# EAGLE design reza-connectboard (EAGLE 6.4)
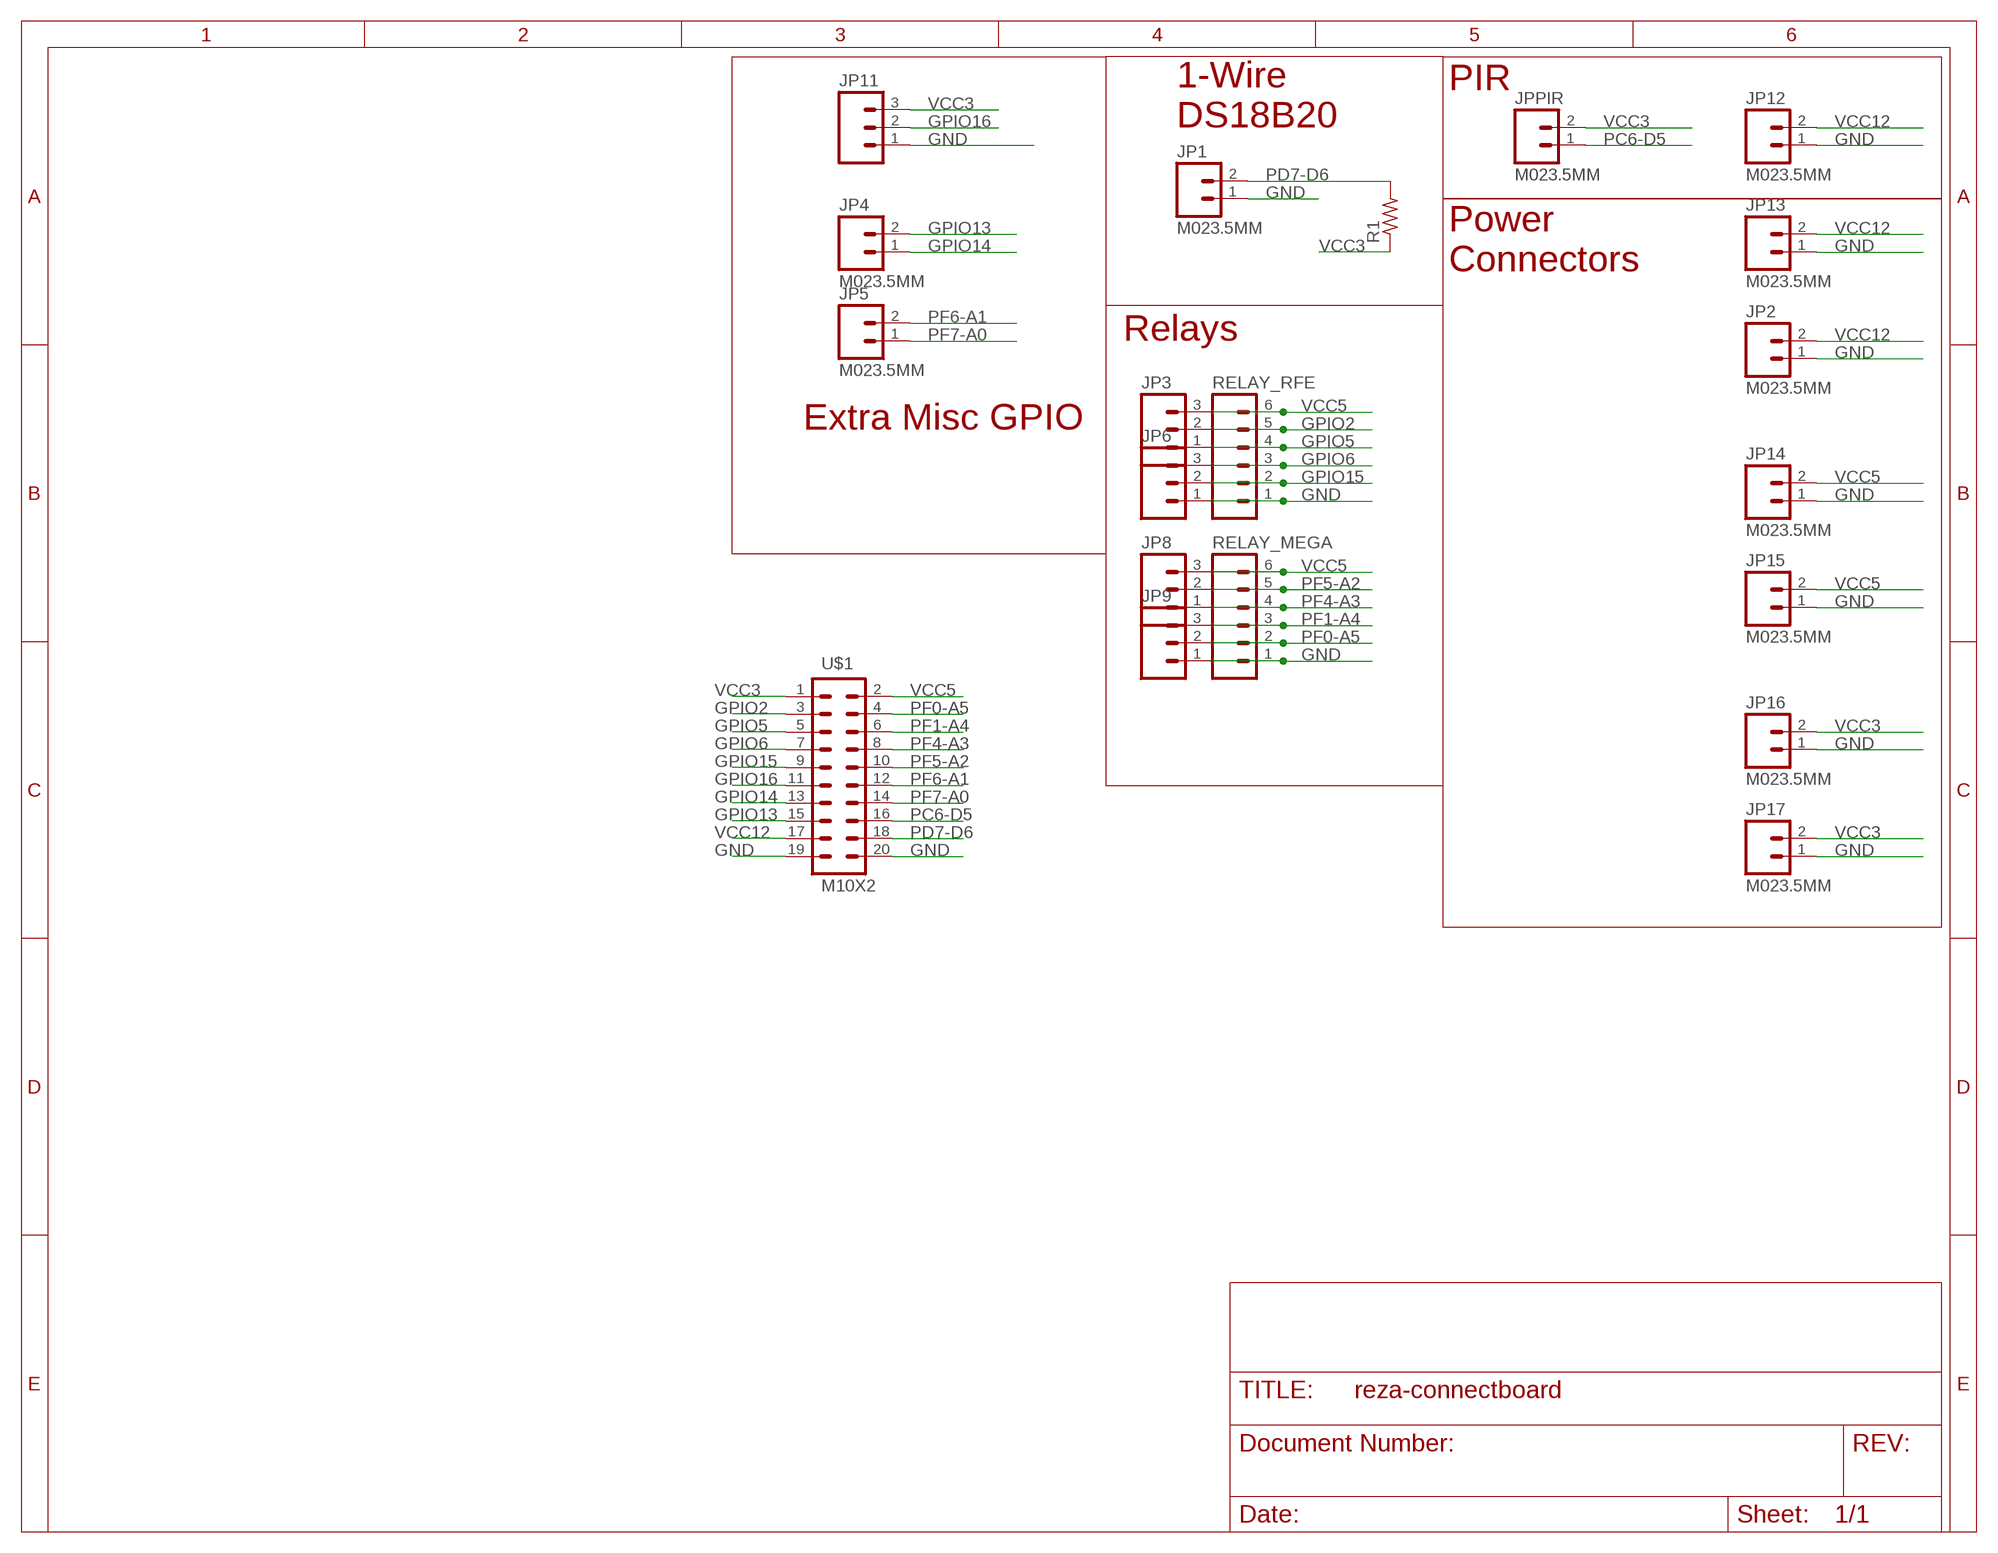
[diagram p0: schematic, sheet 1]

## Parts
JP1  M023.5MM  [SCREWTERMINAL-3.5MM-2]
JP2  M023.5MM  [SCREWTERMINAL-3.5MM-2]
JP3  M03SCREW  [SCREWTERMINAL-3.5MM-3]
JP4  M023.5MM  [SCREWTERMINAL-3.5MM-2]
JP5  M023.5MM  [SCREWTERMINAL-3.5MM-2]
JP6  M03SCREW  [SCREWTERMINAL-3.5MM-3]
JP8  M03SCREW  [SCREWTERMINAL-3.5MM-3]
JP9  M03SCREW  [SCREWTERMINAL-3.5MM-3]
JP11  M03SCREW  [SCREWTERMINAL-3.5MM-3]
JP12  M023.5MM  [SCREWTERMINAL-3.5MM-2]
JP13  M023.5MM  [SCREWTERMINAL-3.5MM-2]
JP14  M023.5MM  [SCREWTERMINAL-3.5MM-2]
JP15  M023.5MM  [SCREWTERMINAL-3.5MM-2]
JP16  M023.5MM  [SCREWTERMINAL-3.5MM-2]
JP17  M023.5MM  [SCREWTERMINAL-3.5MM-2]
JPPIR  M023.5MM  [SCREWTERMINAL-3.5MM-2]
R1  R-US_FLIPFLOP  [0805-THM]
RELAY_MEGA  M06SIP  [1X06]
RELAY_RFE  M06SIP  [1X06]
U$1  M10X2  [2X10]

## Nets
GND: JP1.1 JP2.1 JP6.1 JP9.1 JP11.1 JP12.1 JP13.1 JP14.1 JP15.1 JP16.1 JP17.1 RELAY_MEGA.1 RELAY_RFE.1 U$1.19 U$1.20
GPIO2: JP3.2 RELAY_RFE.5 U$1.3
GPIO5: JP3.1 RELAY_RFE.4 U$1.5
GPIO6: JP6.3 RELAY_RFE.3 U$1.7
GPIO13 [smallsignal]: JP4.2 U$1.15
GPIO14 [smallsignal]: JP4.1 U$1.13
GPIO15: JP6.2 RELAY_RFE.2 U$1.9
GPIO16: JP11.2 U$1.11
PC6-D5 [smallsignal]: JPPIR.1 U$1.16
PD7-D6 [smallsignal]: JP1.2 R1.2 U$1.18
PF0-A5 [smallsignal]: JP9.2 RELAY_MEGA.2 U$1.4
PF1-A4 [smallsignal]: JP9.3 RELAY_MEGA.3 U$1.6
PF4-A3 [smallsignal]: JP8.1 RELAY_MEGA.4 U$1.8
PF5-A2 [smallsignal]: JP8.2 RELAY_MEGA.5 U$1.10
PF6-A1 [smallsignal]: JP5.2 U$1.12
PF7-A0 [smallsignal]: JP5.1 U$1.14
VCC3: JP11.3 JP16.2 JP17.2 JPPIR.2 R1.1 U$1.1
VCC5: JP3.3 JP8.3 JP14.2 JP15.2 RELAY_MEGA.6 RELAY_RFE.6 U$1.2
VCC12 [Power]: JP2.2 JP12.2 JP13.2 U$1.17

## Notes on the sheet
- PIR
- 1-Wire
  DS18B20
- Power
  Connectors
- Relays
- Extra Misc GPIO

## Library data of the parts
JP1 JP2 JP4 JP5 JP12-JP17 JPPIR = SparkFun-Connectors:M02: Standard 2-pin 0.1" header. Use with - straight break away headers ( PRT-00116) - right angle break away headers (PRT-00553) - swiss pins (PRT-00743) - machine pins (PRT-00117) - female headers (PRT-00115) Molex polarized connector foot print use with: PRT-08233 with associated crimp pins and housings. 2.54_SCREWTERM for use with PRT-10571. 3.5mm Screw Terminal footprints for PRT-08084 5mm Screw Terminal footprints for use with PRT-08433
JP3 JP6 JP8 JP9 JP11 = SparkFun-Connectors:M03: Header 3 Standard 3-pin 0.1" header. Use with straight break away headers (SKU : PRT-00116), right angle break away headers (PRT-00553), swiss pins (PRT-00743), machine pins (PRT-00117), and female headers (PRT-00115). Molex polarized connector foot print use with SKU : PRT-08232 with associated crimp pins and housings.
R1 = adafruit:R-US_: RESISTOR, American symbol
RELAY_MEGA RELAY_RFE = SparkFun-Connectors:M06: Header 6 Standard 6-pin 0.1" header. Use with straight break away headers (SKU : PRT-00116), right angle break away headers (PRT-00553), swiss pins (PRT-00743), machine pins (PRT-00117), and female headers (PRT-00115). Molex polarized connector foot print use with SKU : PRT-08094 with associated crimp pins and housings. NOTES ON THE VARIANTS LOCK and LOCK_LONGPADS... This footprint was designed to help hold the alignment of a through-hole component (i.e. 6-pin header) while soldering it into place. You may notice that each hole has been shifted either up or down by 0.005 of an inch from it's more standard position (which is a perfectly straight line). This slight alteration caused the pins (the squares in the middle) to touch the edges of the holes. Because they are alternating, it causes a "brace" to hold the component in place. 0.005 has proven to be the perfect amount of "off-center" position when using our standard breakaway headers. Although looks a little odd when you look at the bare footprint, once you have a header in there, the alteration is very hard to notice. Also,if you push a header all the way into place, it is covered up entirely on the bottom side. This idea of altering the position of holes to aid alignment will be further integrated into the Sparkfun Library for other footprints. It can help hold any component with 3 or more connection pins.
U$1 = SparkFun-Connectors:M10X2: This was SPECIALLY designed to be used with our Graphic LCD Backpack. Be sure you want to use this! It is not only staggered on each line of header holes, but IT IS ALSO offset of the center point of the top and bottom lines by 5 mil. This causes the headers to lock into place on the "standard" footprint on the LCD screen. The extra squares on the tdocu layer are there simply to reference other pins (if you were to actually populate a longer header than ten long - this is what we do with the backpacks).

## Net classes
0 default: width 0.254 mm
1 smallsignal: width 0.254 mm
2 Power: width 0.508 mm

## Board
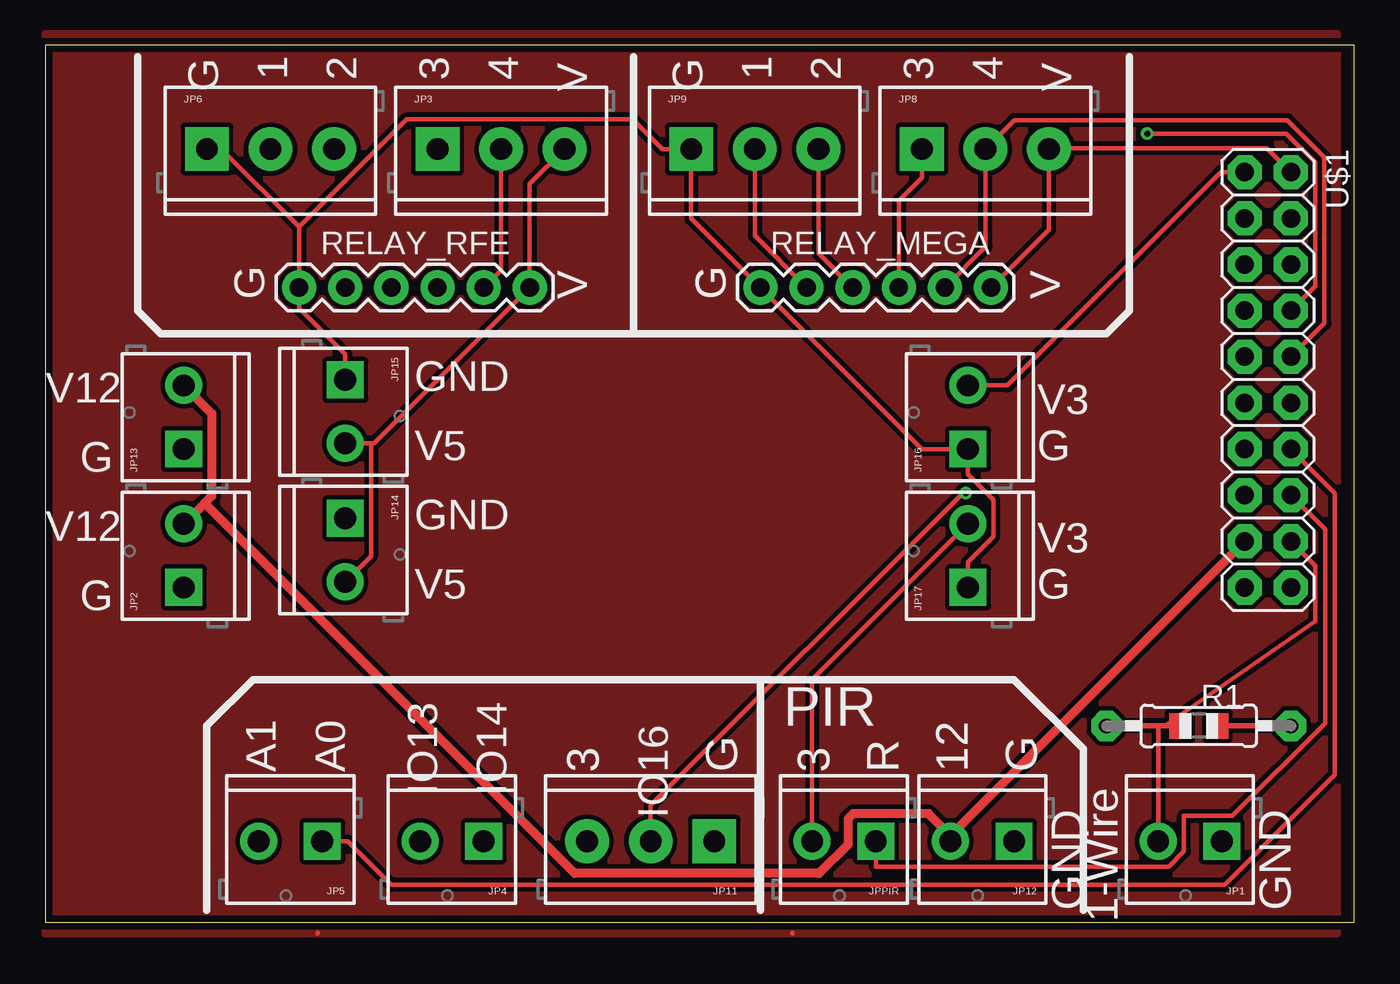
[diagram p1: board, top side]
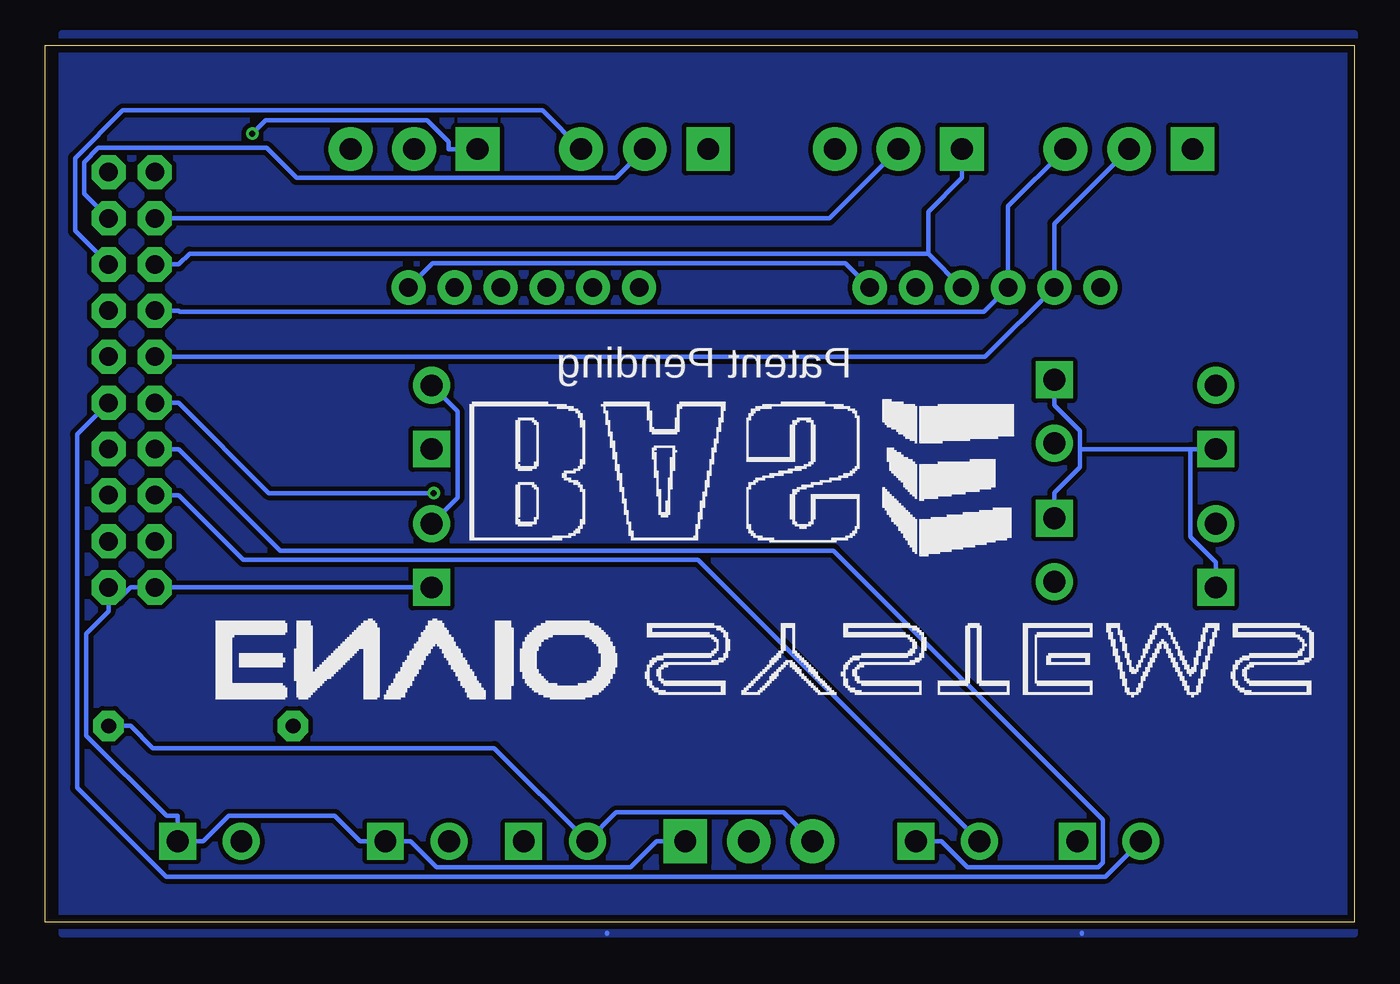
[diagram p2: board, bottom side, seen from below]

Size 72.06 x 48.25 mm. Coordinates in mm from the lower left corner, seen from the top.
Outline: 0,0 72.06,0 72.06,48.25 0,48.25 0,0
Copper layers (1*16): Top 0.0356mm / dielectric 1.5011mm / Bottom 0.0356mm
Design rules "LaenPCBOrder-JCModified *": minimum track width 6mil, minimum drill 13mil, track to track 10mil, track to pad 10mil, pad to pad 10mil, via to via 10mil, smd to smd 10mil, copper to edge 15mil, drill to drill 10mil, minimum pad ring 12mil, minimum via ring 7mil, stop-mask expansion 4mil, vias tented up to drill 25mil, thermal gap 10mil

### Footprints (pad centres in the part's own frame; a part is rotated, then mirrored left to right if it is on the bottom)
SCREWTERMINAL-3.5MM-2 = drill 1.2 pad 2.032 square: 1 0,0 | drill 1.2 pad 2.032: 2 3.5,0
SCREWTERMINAL-3.5MM-3 = drill 1.2 pad 2.413 square: 1 0,0 | drill 1.2 pad 2.413: 2 3.5,0; 3 7,0
0805-THM = drill 0.813 pad 1.676 octagon: 1 -5.08,0; 2 5.08,0
1X06 = drill 1.016 pad 1.88: 1 0,0; 2 2.54,0; 3 5.08,0; 4 7.62,0; 5 10.16,0; 6 12.7,0
2X10 = drill 1.016 pad 1.88 octagon: 1 -11.43,-1.27; 2 -11.43,1.27; 3 -8.89,-1.27; 4 -8.89,1.27; 5 -6.35,-1.27; 6 -6.35,1.27; 7 -3.81,-1.27; 8 -3.81,1.27; 9 -1.27,-1.27; 10 -1.27,1.27; 11 1.27,-1.27; 12 1.27,1.27; 13 3.81,-1.27; 14 3.81,1.27; 15 6.35,-1.27; 16 6.35,1.27; 17 8.89,-1.27; 18 8.89,1.27; 19 11.43,-1.27; 20 11.43,1.27

### Placement (x,y rotation side)
JP1  64.77,4.45 180 top
JP2  7.62,18.41 90 top
JP3  21.59,42.55 0 top
JP4  24.13,4.45 180 top
JP5  15.24,4.45 180 top
JP6  8.89,42.55 0 top
JP8  48.26,42.55 0 top
JP9  35.56,42.55 0 top
JP11  36.83,4.45 180 top
JP12  53.34,4.45 180 top
JP13  7.62,26.04 90 top
JP14  16.51,22.22 270 top
JP15  16.51,29.84 270 top
JP16  50.8,26.04 90 top
JP17  50.8,18.41 90 top
JPPIR  45.72,4.45 180 top
R1  63.5,10.79 180 top
RELAY_MEGA  39.37,34.93 0 top
RELAY_RFE  13.97,34.93 0 top
U$1  67.31,29.84 270 top
U$2  [ENVIOSYS_LOGO2]  34.29,19.05 180 top

### Tracks (layer width: path | path; a pad name or v marks a point on that pad's centre or on a via)
GND
  Top 0.254: JP17.1 50.8,19.81 52.2,21.21 52.2,23.24 50.8,24.64 JP16.1 48.26,26.04 RELAY_MEGA.1 35.56,38.73 JP9.1 33.97,42.55 32.34,44.18 19.89,44.18 13.97,38.26 | 13.97,38.26 RELAY_RFE.1 13.97,33.78 16.51,31.24 JP15.1 | 13.97,38.26 9.68,42.55 JP6.1
  Bottom 0.254: 68.58,17.75 68.02,17.75 67.36,18.41 U$1.19 JP17.1 | 68.58,17.75 68.58,17.09 69.8,15.87 69.8,10.26 65.38,5.84 64.77,5.84 JP1.1 63.37,4.45 61.98,5.84 56.13,5.84 54.74,4.45 JP12.1 51.94,4.45 50.52,3.03 39.84,3.03 38.42,4.45 JP11.1 | U$1.20 68.58,17.75 | 9.02,26.04 9.02,21.21 7.62,19.81 JP2.1 | 15.11,26.04 9.02,26.04 | JP14.1 16.51,23.62 15.11,25.02 15.11,26.04 | 15.11,26.04 15.11,27.05 16.51,28.45 JP15.1 | JP13.1 9.02,26.04
GPIO2
  Top 0.254: JP3.2 25.09,35.89 RELAY_RFE.5
  Bottom 0.254: U$1.3 28.9,38.73 JP3.2
GPIO5
  Bottom 0.254: JP3.1 21.59,40.96 23.45,39.1 23.45,36.79 | 23.45,36.79 RELAY_RFE.4 | 23.45,36.79 64.13,36.79 64.72,36.2 U$1.5
GPIO6
  Bottom 0.254: U$1.7 64.72,33.66 64.66,33.59 20.38,33.59 RELAY_RFE.3 19.05,39.39 JP6.3
GPIO13
  Bottom 0.254: U$1.15 64.72,23.49 61.16,19.94 36.12,19.94 JP4.2
GPIO14
  Bottom 0.254: U$1.13 64.72,26.04 59.13,20.45 28.66,20.45 13.83,5.62 13.83,3.26 14.08,3.01 21.3,3.01 22.73,4.45 JP4.1
GPIO15
  Bottom 0.254: JP6.2 16.51,38.43 RELAY_RFE.2 20.32,31.11 U$1.9
GPIO16  (via drill 0.33 pad 0.69)
  Top 0.254: v50.68,23.61 50.51,23.61 33.33,6.43 JP11.2
  Bottom 0.254: U$1.11 64.72,28.57 59.76,23.61 v50.68,23.61
N$1
  Bottom 0.254: 14.99,-0.64 14.99,-0.58 | 14.99,-0.64 14.99,-0.58 | 14.99,-0.64 14.99,-0.58 | 14.99,-0.64 14.99,-0.58 | 14.99,-0.64 14.99,-0.58 | 14.99,-0.64 14.99,-0.58 | 14.99,-0.64 14.99,-0.58 | 14.99,-0.64 14.99,-0.58 | 41.15,-0.64 41.15,-0.58 | 41.15,-0.64 41.15,-0.58 | 41.15,-0.64 41.15,-0.58 | 41.15,-0.64 41.15,-0.58 | 41.15,-0.64 41.15,-0.58 | 41.15,-0.64 41.15,-0.58
  pour Bottom (isolate 0.254): 0,48.9 0,-0.64 71.12,-0.64 71.12,48.9
N$2
  Top 0.254: 14.99,-0.64 14.99,-0.58 | 14.99,-0.64 14.99,-0.58 | 14.99,-0.64 14.99,-0.58 | 14.99,-0.64 14.99,-0.58 | 14.99,-0.64 14.99,-0.58 | 14.99,-0.64 14.99,-0.58 | 14.99,-0.64 14.99,-0.58 | 14.99,-0.64 14.99,-0.58 | 41.15,-0.64 41.15,-0.58 | 41.15,-0.64 41.15,-0.58 | 41.15,-0.64 41.15,-0.58 | 41.15,-0.64 41.15,-0.58 | 41.15,-0.64 41.15,-0.58 | 41.15,-0.64 41.15,-0.58
  pour Top (isolate 0.254): 0,48.9 0,-0.64 71.12,-0.64 71.12,48.9
PC6-D5
  Top 0.254: U$1.16 70.46,21.61 70.46,10.95 65.35,5.84 62.69,5.84 62.69,3.89 61.85,3.05 45.72,3.05 JPPIR.1
PD7-D6
  Top 0.254: 61.27,10.79 R1.2 | U$1.18 69.93,19.61 69.93,16.55 61.64,10.79 61.27,10.79 | 61.27,10.79 JP1.2
PF0-A5
  Top 0.254: JP9.2 39.06,37.77 RELAY_MEGA.2
  Bottom 0.254: U$1.4 69.92,40.07 69.92,41.83 69.14,42.61 59.88,42.61 58.23,40.96 40.65,40.96 JP9.2
PF1-A4
  Top 0.254: JP9.3 42.56,36.82 RELAY_MEGA.3
  Bottom 0.254: U$1.6 70.43,38.04 70.43,42.04 67.79,44.67 44.69,44.67 JP9.3
PF4-A3  (via drill 0.33 pad 0.69)
  Top 0.254: U$1.8 69.91,34.99 69.91,41.81 68.33,43.4 v60.66,43.4 | JP8.1 48.26,40.96 46.99,39.69 RELAY_MEGA.4
  Bottom 0.254: JP8.1 49.85,42.55 49.85,42.94 51.04,44.13 59.93,44.13 v60.66,43.4
PF5-A2
  Top 0.254: U$1.10 70.42,32.96 70.42,42.08 68.37,44.14 53.35,44.14 JP8.2 51.76,37.16 RELAY_MEGA.5
PF6-A1
  Bottom 0.254: U$1.12 70.31,26.84 70.31,7.4 65.42,2.5 13.69,2.5 JP5.2
PF7-A0
  Top 0.254: JP5.1 16.64,4.45 19.05,2.04 64.94,2.04 71,8.1 71,23.61 U$1.14
VCC3
  Top 0.254: JP16.2 52.98,29.54 64.72,41.27 U$1.1 | JP17.2 42.22,13.34 JPPIR.2
  Bottom 0.254: JP16.2 49.38,28.11 49.38,23.34 JP17.2 | R1.1 67.36,10.79 66.14,9.58 47.35,9.58 JPPIR.2 40.63,6.04 31.42,6.04 JP11.3
VCC5
  Top 0.254: 17.93,26.34 JP15.2 | 17.93,26.34 18.09,26.34 RELAY_RFE.6 26.67,40.62 JP3.3 | 17.93,26.34 17.93,20.14 JP14.2 | U$1.2 67.25,42.6 55.32,42.6 JP8.3 55.26,38.12 RELAY_MEGA.6
  Bottom 0.254: RELAY_RFE.6 28,36.26 50.74,36.26 RELAY_MEGA.6
VCC12
  Top 0.508: 49.84,4.75 JP12.2 | U$1.17 49.84,4.75 | 49.84,4.75 48.63,5.97 44.49,5.97 44.2,5.68 44.2,4.26 42.61,2.67 29.15,2.67 8.76,23.06 | 8.76,23.06 JP2.2 | JP13.2 9.17,27.99 9.17,23.46 8.76,23.06

### Text on the board
tPlace: 1 | 2 | 3 | 4 | 1 | 2 | 3 | 4 | G | V | G | V | G | V | G | G | V | GND | V12 | V3 | V5 | G | G | V12 | GND | V3 | G | V5 | G | PIR | A1 | A0 | 3 | G | 3 | R | 12 | G | IO13 | IO14 | IO16 | GND | 1-Wire | GND